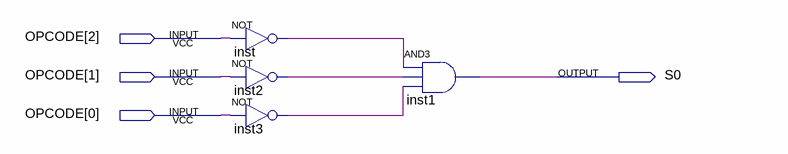
[diagram p0: schematic sheet]
// Quartus schematic DecoNOP.bdf as structural Verilog: 4 symbols, 4 pins
module DecoNOP (
  input  [2:0] OPCODE,
  output S0
);

  wire inst2_out, inst3_out, inst_out;

  not inst (inst_out, OPCODE[2]);
  not inst2 (inst2_out, OPCODE[1]);
  not inst3 (inst3_out, OPCODE[0]);
  and inst1 (S0, inst_out, inst2_out, inst3_out);
endmodule
